# Altium schematic sheet Audio-Beamformer_HDMI_V1.0.SchDoc: Audio-Beamformer
size A4; PageSetup: Record=PageOptions|CenterHorizontal=True|CenterVertical=True|PrintScale=0.97|XCorrection=1.00|YCorrection=1.00|PrintKind=0|BorderSize=5000000|LeftOffset=0|BottomOffset=0|Orientation=2|PaperLength=1000|PaperWidth=1000|Scale=100|PaperSource=7|PrintQuality=-3|MediaType=1|DitherType=10|PrintScaleMode=1|PaperKind=A4|PaperIndex=9; Organization: Ostschweizer Fachhochschule; Address2: Florian Baumgartner & Thierry Schwaller; Address3: florian.baumgartner@ost.ch; DocumentNumber: 6; Revision: V1.0; SheetNumber: 6; SheetTotal: 10; Author: Florian Baumgartner & Thierry Schwaller; Subtitle: HDMI
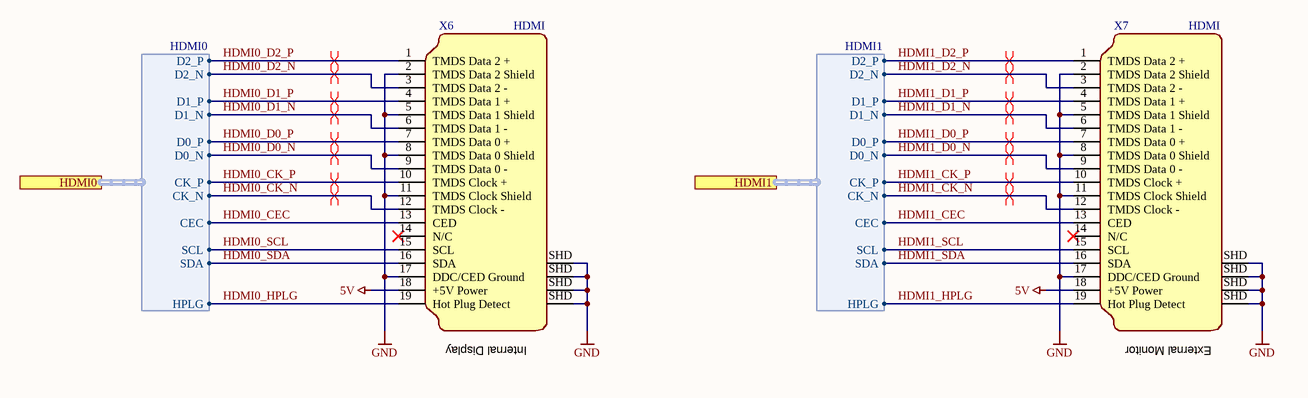
[diagram p0: Audio-Beamformer_HDMI_V1.0.SchDoc]

## Parts
X6  HDMI  [SMD HDMI Horizontal]
X7  HDMI  [SMD HDMI Horizontal]

## Ports
HDMI0 (harness HDMI0), HDMI1 (harness HDMI1)

## Harnesses
HDMI1: D2_N, D1_P, D2_P, D1_N, D0_P, D0_N, CK_N, CK_P, CEC, SCL, SDA, HPLG
HDMI0: D2_N, D1_P, D2_P, D1_N, D0_P, D0_N, CK_N, CK_P, CEC, SCL, SDA, HPLG

## Nets
5V: X6.18(+5V_Power) X7.18(+5V_Power)
GND: X6.2(TMDS_Data_2_Shield) X6.5(TMDS_Data_1_Shield) X6.8(TMDS_Data_0_Shield) X6.11(TMDS_Clock_Shield) X6.17(DDC/CED_Ground) X6.SHD X7.2(TMDS_Data_2_Shield) X7.5(TMDS_Data_1_Shield) X7.8(TMDS_Data_0_Shield) X7.11(TMDS_Clock_Shield) X7.17(DDC/CED_Ground) X7.SHD
HDMI0_CEC: X6.13(CED) ; port HDMI0.CEC
HDMI0_CK_N: X6.12(TMDS_Clock_-) ; port HDMI0.CK_N
HDMI0_CK_P: X6.10(TMDS_Clock_+) ; port HDMI0.CK_P
HDMI0_D0_N: X6.9(TMDS_Data_0_-) ; port HDMI0.D0_N
HDMI0_D0_P: X6.7(TMDS_Data_0_+) ; port HDMI0.D0_P
HDMI0_D1_N: X6.6(TMDS_Data_1_-) ; port HDMI0.D1_N
HDMI0_D1_P: X6.4(TMDS_Data_1_+) ; port HDMI0.D1_P
HDMI0_D2_N: X6.3(TMDS_Data_2_-) ; port HDMI0.D2_N
HDMI0_D2_P: X6.1(TMDS_Data_2_+) ; port HDMI0.D2_P
HDMI0_HPLG: X6.19(Hot_Plug_Detect) ; port HDMI0.HPLG
HDMI0_SCL: X6.15(SCL) ; port HDMI0.SCL
HDMI0_SDA: X6.16(SDA) ; port HDMI0.SDA
HDMI1_CEC: X7.13(CED) ; port HDMI1.CEC
HDMI1_CK_N: X7.12(TMDS_Clock_-) ; port HDMI1.CK_N
HDMI1_CK_P: X7.10(TMDS_Clock_+) ; port HDMI1.CK_P
HDMI1_D0_N: X7.9(TMDS_Data_0_-) ; port HDMI1.D0_N
HDMI1_D0_P: X7.7(TMDS_Data_0_+) ; port HDMI1.D0_P
HDMI1_D1_N: X7.6(TMDS_Data_1_-) ; port HDMI1.D1_N
HDMI1_D1_P: X7.4(TMDS_Data_1_+) ; port HDMI1.D1_P
HDMI1_D2_N: X7.3(TMDS_Data_2_-) ; port HDMI1.D2_N
HDMI1_D2_P: X7.1(TMDS_Data_2_+) ; port HDMI1.D2_P
HDMI1_HPLG: X7.19(Hot_Plug_Detect) ; port HDMI1.HPLG
HDMI1_SCL: X7.15(SCL) ; port HDMI1.SCL
HDMI1_SDA: X7.16(SDA) ; port HDMI1.SDA

Not connected (* = marked no-connect by the designer): X6 14(N/C)*; X7 14(N/C)*

## Layout directives
differential pair: HDMI0_CK_N, HDMI0_CK_P, HDMI0_D0_N, HDMI0_D0_P, HDMI0_D1_N, HDMI0_D1_P, HDMI0_D2_N, HDMI0_D2_P, HDMI1_CK_N, HDMI1_CK_P, HDMI1_D0_N, HDMI1_D0_P, HDMI1_D1_N, HDMI1_D1_P, HDMI1_D2_N, HDMI1_D2_P

## Notes on the sheet
- (near X6) Internal Display
- (near X7) External Monitor
- Title
- Author:
- Subtitle
- Date:
- Rev:
- File:
- Sheet
- of

## Library data of the parts
X6 X7 = X-HDMI-Connector: Female Right Angle; Component Description: HDMI-Connector (Female Right Angle); Component Value: HDMR-19-01-S-SM; Digikey: SAM9475-ND; Farnell: 3742389; Mouser: 200-HDMR-19-01-SSMTR; ComponentLink1Description: Datasheet; ComponentLink1URL: https://datasheet.lcsc.com/lcsc/1811111311_BOOMELE-Boom-Precision-Elec-C138388_C138388.pdf; JLC-Parts: C138388; Unit Price: 0.21